# EAGLE design SimpleServo2 (EAGLE 9.6.2)
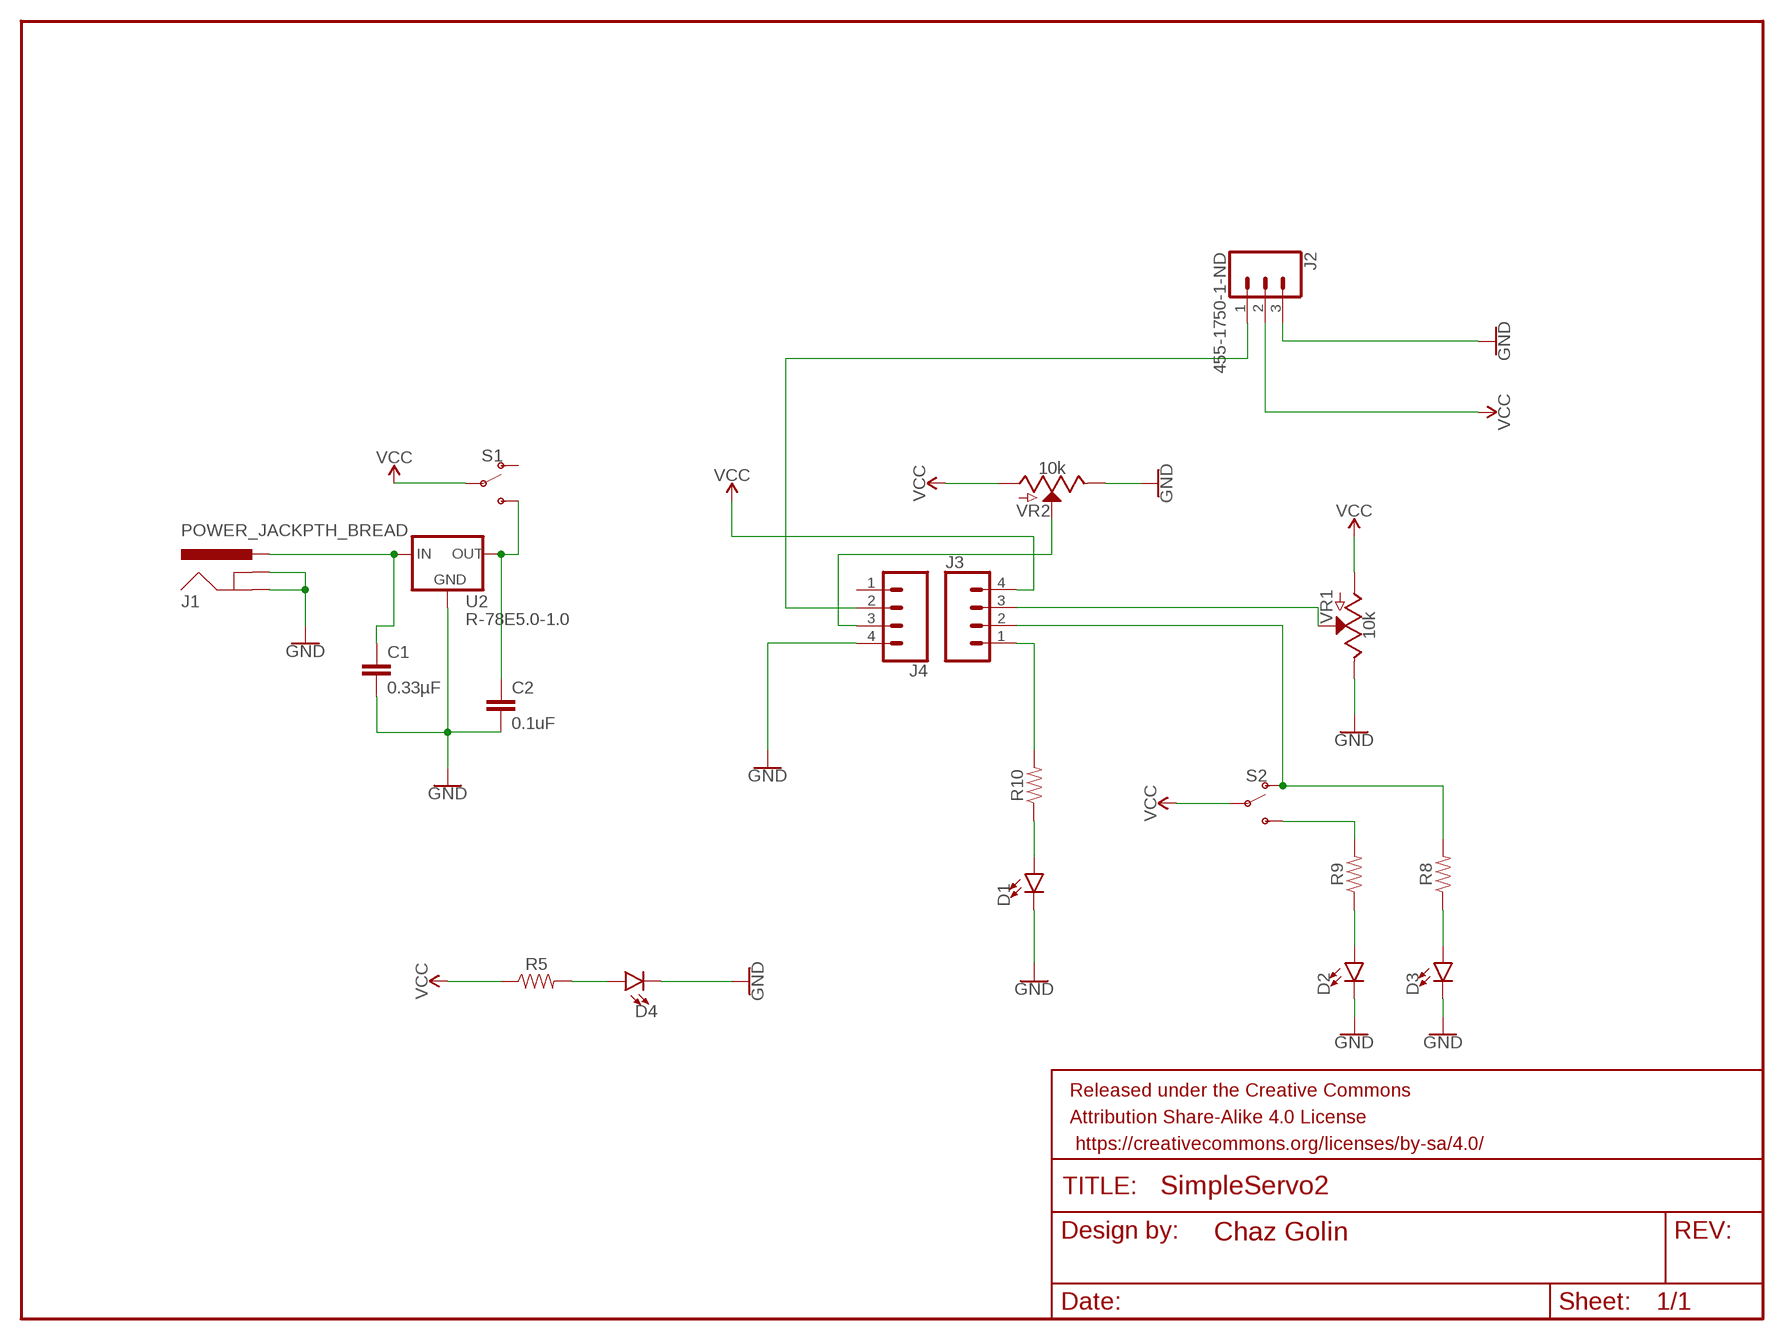
[diagram p0: schematic, sheet 1]

## Parts
C1  0.33µF  0.33UF/330NF-0805-50V-10%  [0805]
C2  0.1uF  0.1UF-0402-6.3V-10%-X7R  [0402]
D1  LED3MM  [LED_3MM]
D2  LED3MM  [LED_3MM]
D3  LED3MM  [LED_3MM]
D4  LED3MM  [LED_3MM]
FRAME1  FRAME-LETTER  [CREATIVE_COMMONS]
J1  POWER_JACKPTH_BREAD  [POWER_JACK_PTH_BREAD]
J2  455-1750-1-ND  CONN_03  [1X03]
J3  CONN_041X04_NO_SILK  [1X04_NO_SILK]
J4  CONN_041X04_NO_SILK  [1X04_NO_SILK]
R5  RESISTORAXIAL-0.3  [AXIAL-0.3]
R8  RESISTORAXIAL-0.3  [AXIAL-0.3]
R9  RESISTORAXIAL-0.3  [AXIAL-0.3]
R10  RESISTORAXIAL-0.3  [AXIAL-0.3]
S1  SWITCH-SPDT-PTH-11.6X4.0MM  [SWITCH_SPDT_PTH_11.6X4.0MM]
S2  SWITCH-SPDT-PTH-11.6X4.0MM  [SWITCH_SPDT_PTH_11.6X4.0MM]
U2  R-78E5.0-1.0  [DC-DC_CONVERTER_78XX]
VR1  10k  POTENTIOMETER-PTH-9MM-1/20W-20%  [POT-PTH-ALPS]
VR2  10k  POTENTIOMETER-PTH-9MM-1/20W-20%  [POT-PTH-ALPS]

## Nets
GND: C1.2 C2.2 D1.K(C) D2.K(C) D3.K(C) D4.K(C) J1.GND J1.GNDBREAK J2.3 J4.4 U2.GND VR1.P$1(E) VR2.P$1(E)
N$1: C1.1 J1.PWR U2.VIN(IN)
N$2: C2.1 S1.3(S) U2.VOUT(OUT)
N$3: J3.1 R10.P$2
N$4: J3.3 VR1.P$2(S)
N$5: D1.A R10.P$1
N$6: J4.3 VR2.P$2(S)
N$7: J3.2 R8.P$2 S2.1(O)
N$8: R9.P$2 S2.3(S)
N$9: D2.A R9.P$1
N$10: D3.A R8.P$1
N$11: J2.1 J4.2
N$12: D4.A R5.P$2
VCC: J2.2 J3.4 R5.P$1 S1.2(P) S2.2(P) VR1.P$3(A) VR2.P$3(A)
Unconnected: J4.1 S1.1(O)

## Library data of the parts
C1 = SparkFun-Capacitors:0.33UF/330NF: 0.33µF/330nF ceramic capacitors A capacitor is a passive two-terminal electrical component used to store electrical energy temporarily in an electric field.; PROD_ID: CAP-08469
C2 = SparkFun-Capacitors:0.1UF: 0.1µF ceramic capacitors A capacitor is a passive two-terminal electrical component used to store electrical energy temporarily in an electric field.; PROD_ID: CAP-14993
D1-D4 = SparkFun-LED:LED: LED (Generic) Standard schematic elements and footprints for 5mm, 3mm, 1206, and 0603 sized LEDs. Generic LEDs with no color specified.; PROD_ID: DIO-08794
FRAME1 = SparkFun-Aesthetics:FRAME-LETTER: Schematic Frame - Letter Standard 8.5x11 US Letter frame; DESIGNER: Chaz Golin
J1 = SparkFun-Connectors:POWER_JACK: Power Jack Connector This is the standard 5.5mm barrel jack for power. The PTH is the most common, proven, reliable, footprint. The Slot footprint only works if the mill layer is transmitted to the PCB fab house so be warned. Here are the connectors we sell at SparkFun: DC Barrel Power Jack/Connector <https://www.sparkfun.com/products/119> (PRT-00119) DC Barrel Power Jack/Connector (SMD) <https://www.sparkfun.com/products/12748> (PRT-12748) DC Barrel Jack Adapter - Breadboard Compatible <https://www.sparkfun.com/products/10811> (PRT-10811) It is used on this SparkFun product (and many, many others): SparkFun RedBoard - Programmed with Arduino <https://www.sparkfun.com/products/12757> (DEV-12757) Also, if you need a mating power supply or connector, please check these out: Wall Adapter Power Supply - 9VDC 650mA <https://www.sparkfun.com/products/298> (TOL-00298) DC Barrel Jack Adapter - Male <https://www.sparkfun.com/products/10287> (PRT-10287); PROD_ID: COMP-13253
J2 = SparkFun-Connectors:CONN_03: Multi connection point. Often used as Generic Header-pin footprint for 0.1 inch spaced/style header connections On any of the 0.1 inch spaced packages, you can populate with these: Break Away Headers - Straight <https://www.sparkfun.com/products/116> (PRT-00116) Break Away Male Headers - Right Angle <https://www.sparkfun.com/products/553> (PRT-00553) Female Headers <https://www.sparkfun.com/products/115> (PRT-00115) Break Away Headers - Machine Pin <https://www.sparkfun.com/products/117> (PRT-00117) Break Away Female Headers - Swiss Machine Pin <https://www.sparkfun.com/products/743> (PRT-00743) Stackable Header - 3 Pin (Female, 0.1") <https://www.sparkfun.com/products/13875> (PRT-13875) For SCREWTERMINALS and SPRING TERMINALS visit here: Screw Terimnals on SparkFun.com <https://www.sparkfun.com/search/results?term=Screw+Terminals> (5mm/3.5mm/2.54mm spacing) This device is also useful as a general connection point to wire up your design to another part of your project. Our various solder wires solder well into these plated through hole pads. Hook-Up Wire - Assortment (Stranded, 22 AWG) <https://www.sparkfun.com/products/11375> (PRT-11375) Hook-Up Wire - Assortment (Solid Core, 22 AWG) <https://www.sparkfun.com/products/11367> (PRT-11367) View the entire wire category on our website here <https://www.sparkfun.com/categories/141> Special notes: Molex polarized connector foot print use with SKU : PRT-08232 with associated crimp pins and housings.; PROD_ID: XXX-00000
J3 J4 = SparkFun-Connectors:CONN_04: Multi connection point. Often used as Generic Header-pin footprint for 0.1 inch spaced/style header connections On any of the 0.1 inch spaced packages, you can populate with these: Break Away Headers - Straight <https://www.sparkfun.com/products/116> (PRT-00116) Break Away Male Headers - Right Angle <https://www.sparkfun.com/products/553> (PRT-00553) Female Headers <https://www.sparkfun.com/products/115> (PRT-00115) Break Away Headers - Machine Pin <https://www.sparkfun.com/products/117> (PRT-00117) Break Away Female Headers - Swiss Machine Pin <https://www.sparkfun.com/products/743> (PRT-00743) For SCREWTERMINALS and SPRING TERMINALS visit here: Screw Terimnals on SparkFun.com <https://www.sparkfun.com/search/results?term=Screw+Terminals> (5mm/3.5mm/2.54mm spacing) This device is also useful as a general connection point to wire up your design to another part of your project. Our various solder wires solder well into these plated through hole pads. Hook-Up Wire - Assortment (Stranded, 22 AWG) <https://www.sparkfun.com/products/11375> (PRT-11375) Hook-Up Wire - Assortment (Solid Core, 22 AWG) <https://www.sparkfun.com/products/11367> (PRT-11367) View the entire wire category on our website here <https://www.sparkfun.com/categories/141> Special notes: Molex polarized connector foot print use with SKU : PRT-08231 with associated crimp pins and housings. 1MM SMD Version SKU: PRT-10208; PROD_ID: CONN-09696
R5 R8-R10 = SparkFun-Resistors:RESISTOR: Generic Resistor Package
S1 S2 = SparkFun-Switches:SWITCH-SPDT: Single Pole, Double Throw (SPDT) Switch Single-pole, double-throw (SPDT) switch. Variant Overview SMD-AYZ0202 Surface Mount DPDT Switch <https://www.sparkfun.com/products/597> (COM-00597) Used on e.g. LilyPad Arduino USB - ATmega32U4 Board <https://www.sparkfun.com/products/12049> PTH-11.6X4.0MM SPDT Mini Power Switch <https://www.sparkfun.com/products/102> (COM-00102) Used on e.g. SparkFun Simon Says - Through-Hole Soldering Kit <https://www.sparkfun.com/products/10547> (KIT-10547) PTH-11.6X4.0MM-KIT KIT version of SPDT Mini Power Switch - Simplifies soldering by removing tStop of switch pins - only one side can be soldered. PTH-11.6X4.0MM-LOCK LOCK version of SPDT Mini Power Switch - Offset pins hold switch in place for easier soldering. SMD-RIGHT-ANGLE Surface Mount Right Angle Switch <https://www.sparkfun.com/products/10860> (COM-10860) Used on e.g. SparkFun ESP8266 Thing <https://www.sparkfun.com/products/13231>; PROD_ID: SWCH-08261; SF_SKU: COM-00102
U2 = SparkFun-IC-Power:R-78E5.0-1.0: Recom Power 5V 1A DC/DC Converter The Recom R-78E5.0-X.X is a compact DC/DC converter module that is a pin for pin drop-in replacement for the LM7805 linear voltage regulator. Specifications: Input Range: 7-28V Output Voltage: 5V Output Current: 1A Max Efficiency: 91% Datasheet <https://www.recom-power.com/pdf/Innoline/R-78Exx-1.0.pdf>; PROD_ID: COM-13655
VR1 VR2 = SparkFun-Resistors:POTENTIOMETER: Potentiometer (Pot) Three-terminal potentiometers, with an adjustable wiper and two adjustable resistors. A pot can be used to create a configurable voltage divider, or as a variable resistor. Variants ALPS_POT and ALPS_POT_KIT - PTH, breadboard compatible, 9mm square pots Rotary Potentiometer - Linear (10k ohm) <https://www.sparkfun.com/products/9288> (COM-09288) The KIT variant exposes copper on only one side of the PTH pad, so the part can only be assembled on one side of the PCB. Useful for beginner soldering kits.; PROD_ID: RES-09177; SF_SKU: COM-09288

## Board
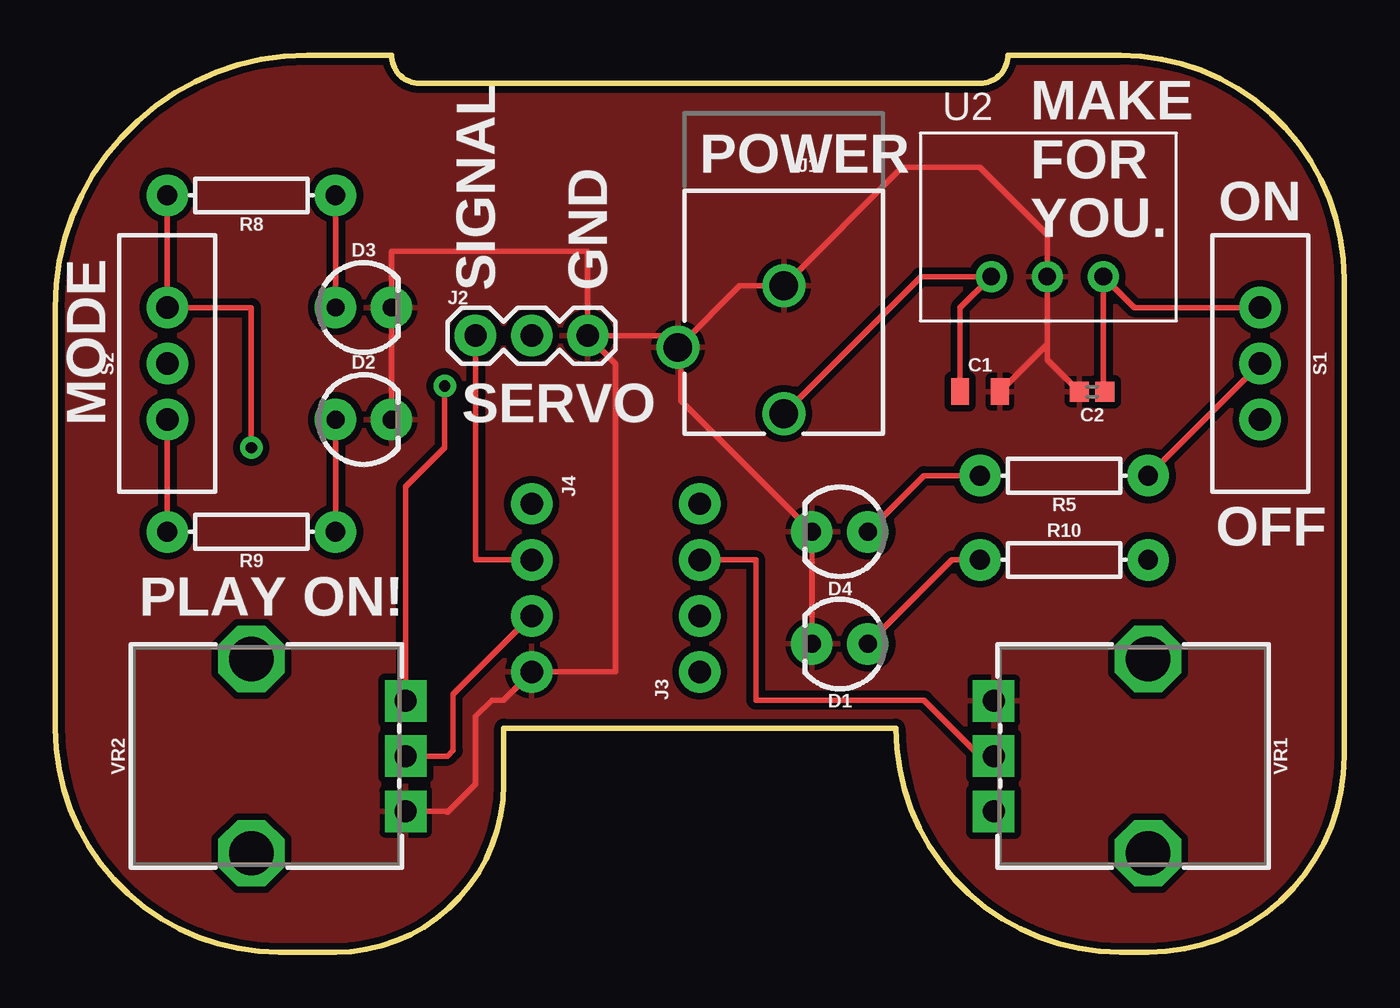
[diagram p1: board, top side]
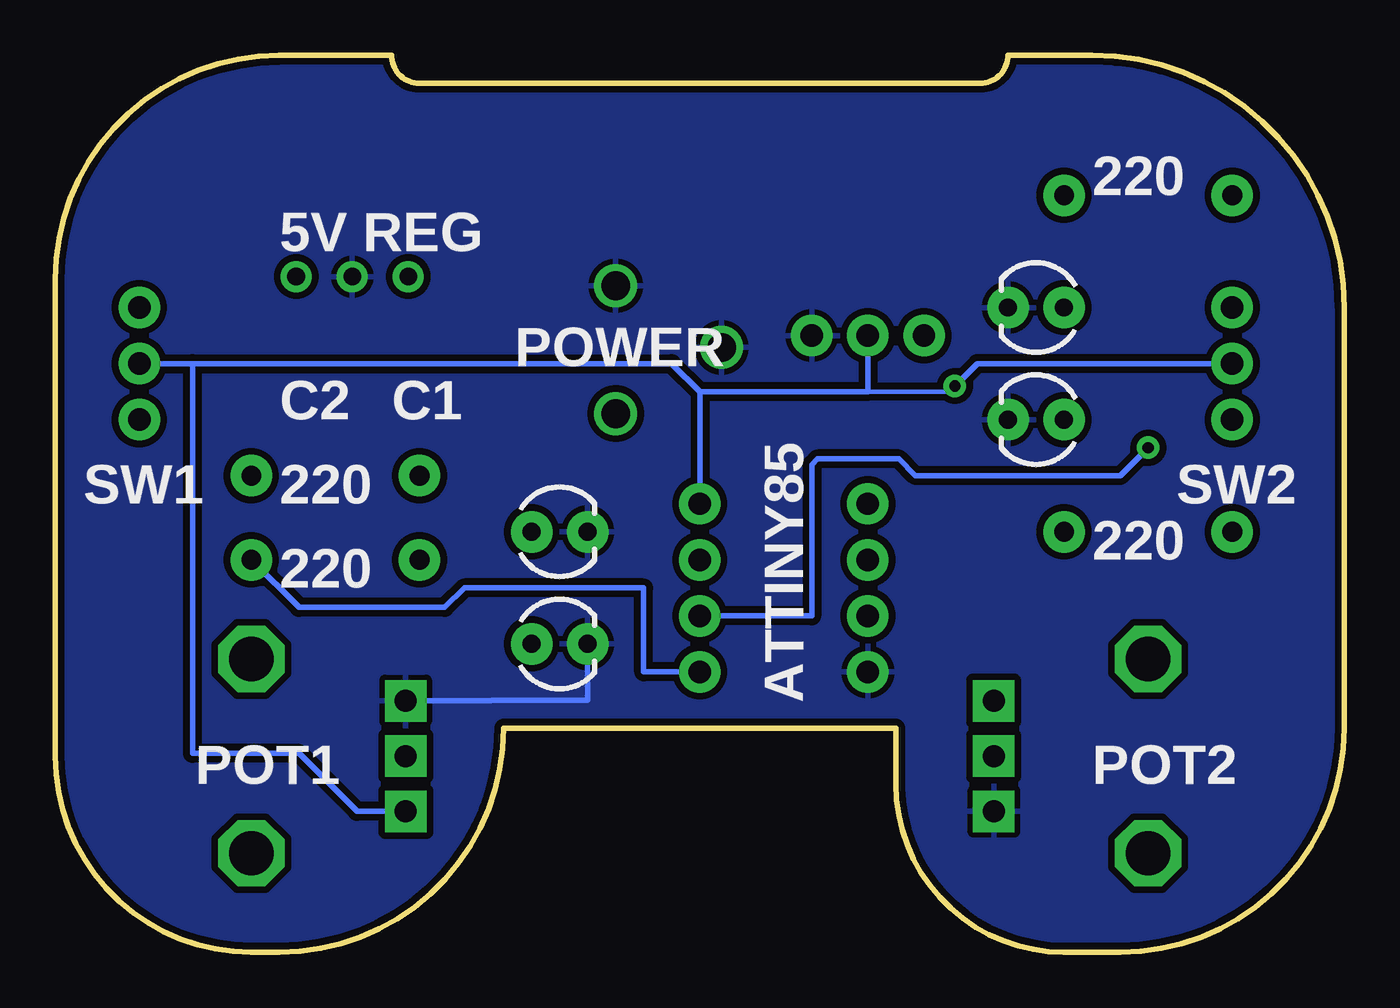
[diagram p2: board, bottom side, seen from below]

Size 58.42 x 40.64 mm. Coordinates in mm from the lower left corner, seen from the top.
Outline: 15.24,40.64 arc90 16.51,39.37 41.91,39.37 arc90 43.18,40.64 48.26,40.64 arc-90 58.42,30.48 58.42,8.89 arc-90 49.53,0 48.26,0 arc-90 38.1,10.16 20.32,10.16 20.32,7.62 arc-90 12.7,0 10.16,0 arc-90 0,10.16 0,29.21 arc-90 11.43,40.64 15.24,40.64
Copper layers (1*16): Top 0.035mm / dielectric 1.5mm / Bottom 0.035mm
Design rules "SparkFun": minimum track width 8mil, minimum drill 20mil, track to track 8mil, track to pad 8mil, pad to pad 8mil, via to via 8mil, smd to smd 8mil, copper to edge 8mil, drill to drill 8mil, minimum pad ring 12mil, minimum via ring 10mil, stop-mask expansion 4mil, vias tented up to drill 20mil, thermal gap 10mil

### Footprints (pad centres in the part's own frame; a part is rotated, then mirrored left to right if it is on the bottom)
0805 = smd 0.8 x 1.2: 1 -0.9,0; 2 0.9,0
0402 = smd 0.85 x 0.9: 1 -0.58,0; 2 0.58,0
LED_3MM = drill 0.813 pad 1.88: A -1.27,0; K 1.27,0
POWER_JACK_PTH_BREAD = drill 1.3: GND 0,7.9; GNDBREAK 4.8,10.7; PWR 0,13.7
1X03 = drill 1.016 pad 1.88: 1 0,0; 2 2.54,0; 3 5.08,0
1X04_NO_SILK = drill 1.016 pad 1.88: 1 0,0; 2 2.54,0; 3 5.08,0; 4 7.62,0
AXIAL-0.3 = drill 0.9 pad 1.88: P$1 -3.81,0; P$2 3.81,0
SWITCH_SPDT_PTH_11.6X4.0MM = drill 1.016 pad 1.88: 1 0,2.54; 2 0,0; 3 0,-2.54
DC-DC_CONVERTER_78XX = drill 0.8: GND 0,0; VIN -2.54,0; VOUT 2.54,0
POT-PTH-ALPS = drill 1 pad 1.88 square: P$1 7,-2.5; P$2 7,0; P$3 7,2.5 | drill 2 octagon: P$4 0,-4.4; P$5 0,4.4

### Placement (x,y rotation side)
C1  41.91,25.4 0 top
C2  46.99,25.4 180 top
D1  35.56,13.97 180 top
D2  13.97,24.13 0 top
D3  13.97,29.21 0 top
D4  35.56,19.05 180 top
FRAME1  -110.49,5.08 0 top  (outside the outline)
J1  33.02,38.1 180 top
J2  19.05,27.94 0 top
J3  29.21,12.7 90 top
J4  21.59,20.32 270 top
R5  45.72,21.59 180 top
R8  8.89,34.29 180 top
R9  8.89,19.05 180 top
R10  45.72,17.78 0 top
S1  54.61,26.67 180 top
S2  5.08,26.67 0 top
U2  44.96,30.61 0 top
VR1  49.53,8.89 180 top
VR2  8.89,8.89 0 top

### Tracks (layer width: path | path; a pad name or v marks a point on that pad's centre or on a via)
GND
  Top 0.254: 28.35,27.53 J1.GNDBREAK 27.68,27.94 J2.3 | 28.35,27.53 31.02,30.2 J1.GND 38.38,35.56 41.91,35.56 44.96,32.51 U2.GND 44.96,27.55 | C1.2 44.96,27.55 | C2.2 44.96,26.85 44.96,27.55 | 28.35,27.53 28.35,24.99 D4.K D1.K | VR2.P$1 17.74,6.39 17.78,6.35 19.05,7.62 19.05,10.69 19.79,11.43 20.32,11.43 J4.4 25.4,12.7 25.4,26.67 J2.3 | D2.K D3.K 15.24,31.75 24.13,31.75 J2.3
  Bottom 0.254: VR1.P$1 38.67,11.39 38.63,11.43 34.29,11.43 D1.K
  pour Top (isolate 0.305): 44.45,40.64 48.26,40.64 arc-90 58.42,30.48 58.42,10.16 58.42,8.89 arc-90 49.53,0 48.26,0 arc-90 38.1,10.16 21.59,10.16 20.32,10.16 20.32,7.62 arc-90 12.7,0 10.16,0 arc-90 0,10.16 0,26.67 0,29.21 arc-90 11.43,40.64 15.24,40.64 arc90 16.51,39.37 41.91,39.37 arc90 43.18,40.64
  pour Bottom (isolate 0.305): 44.45,40.64 48.26,40.64 arc-90 58.42,30.48 58.42,8.89 arc-90 49.53,0 48.26,0 arc-90 38.1,10.16 20.32,10.16 20.32,7.62 arc-90 12.7,0 10.16,0 arc-90 0,10.16 0,26.67 0,29.21 arc-90 11.43,40.64 15.24,40.64 arc90 16.51,39.37 41.91,39.37 arc90 43.18,40.64
N$1
  Top 0.254: J1.PWR 39.23,30.61 U2.VIN 41.01,29.2 C1.1
N$2
  Top 0.254: C2.1 47.5,25.47 U2.VOUT 48.89,29.21 S1.3
N$3
  Bottom 0.254: J3.1 31.75,12.7 31.75,16.51 39.88,16.51 40.77,15.62 47.37,15.62 R10.P$2
N$4
  Top 0.254: VR1.P$2 41.91,8.89 39.37,11.43 31.75,11.43 31.75,17.78 J3.3
N$5
  Top 0.254: D1.A 40.64,17.78 R10.P$1
N$6
  Top 0.254: VR2.P$2 17.78,8.89 18.03,9.14 18.03,11.68 J4.3
N$7  (via drill 0.51)
  Top 0.254: R8.P$2 S2.1 8.89,29.21 v8.89,22.86
  Bottom 0.254: v8.89,22.86 10.16,21.59 19.43,21.59 20.19,22.35 23.88,22.35 24.13,22.1 24.13,15.24 J3.2
N$8
  Top 0.254: S2.3 R9.P$2
N$9
  Top 0.254: D2.A R9.P$1
N$10
  Top 0.254: R8.P$1 D3.A
N$11
  Top 0.254: J2.1 19.05,17.78 J4.2
N$12
  Top 0.254: D4.A 39.37,21.59 R5.P$2
VCC  (via drill 0.51)
  Top 0.254: R5.P$1 S1.2 | VR2.P$3 15.89,21.1 17.65,22.86 v17.65,25.65
  Bottom 0.203: v17.65,25.65 17.91,25.4 21.59,25.4
  Bottom 0.254: S1.2 52.2,26.67 | 52.2,26.67 30.48,26.67 29.21,25.4 | 29.21,25.4 J3.4 | J2.2 21.59,25.4 29.21,25.4 | v17.65,25.65 16.64,26.67 S2.2 | VR1.P$3 44.74,6.39 47.37,9.02 52.2,9.02 52.2,26.67

### Text on the board
tPlace: POWER | ON | MAKE / FOR / YOU. | SIGNAL | GND | MODE | SERVO | OFF | PLAY ON!
bPlace: 220 | 5V REG | POWER | C1 | C2 | ATTINY85 | SW2 | 220 | SW1 | 220 | 220 | POT2 | POT1